# Altium schematic sheet ethernet.SchDoc
size 594 x 420 mm; Author: ALTIUM GOSTBOM2.0 KEV; SheetNumber: 3; SheetTotal: 3
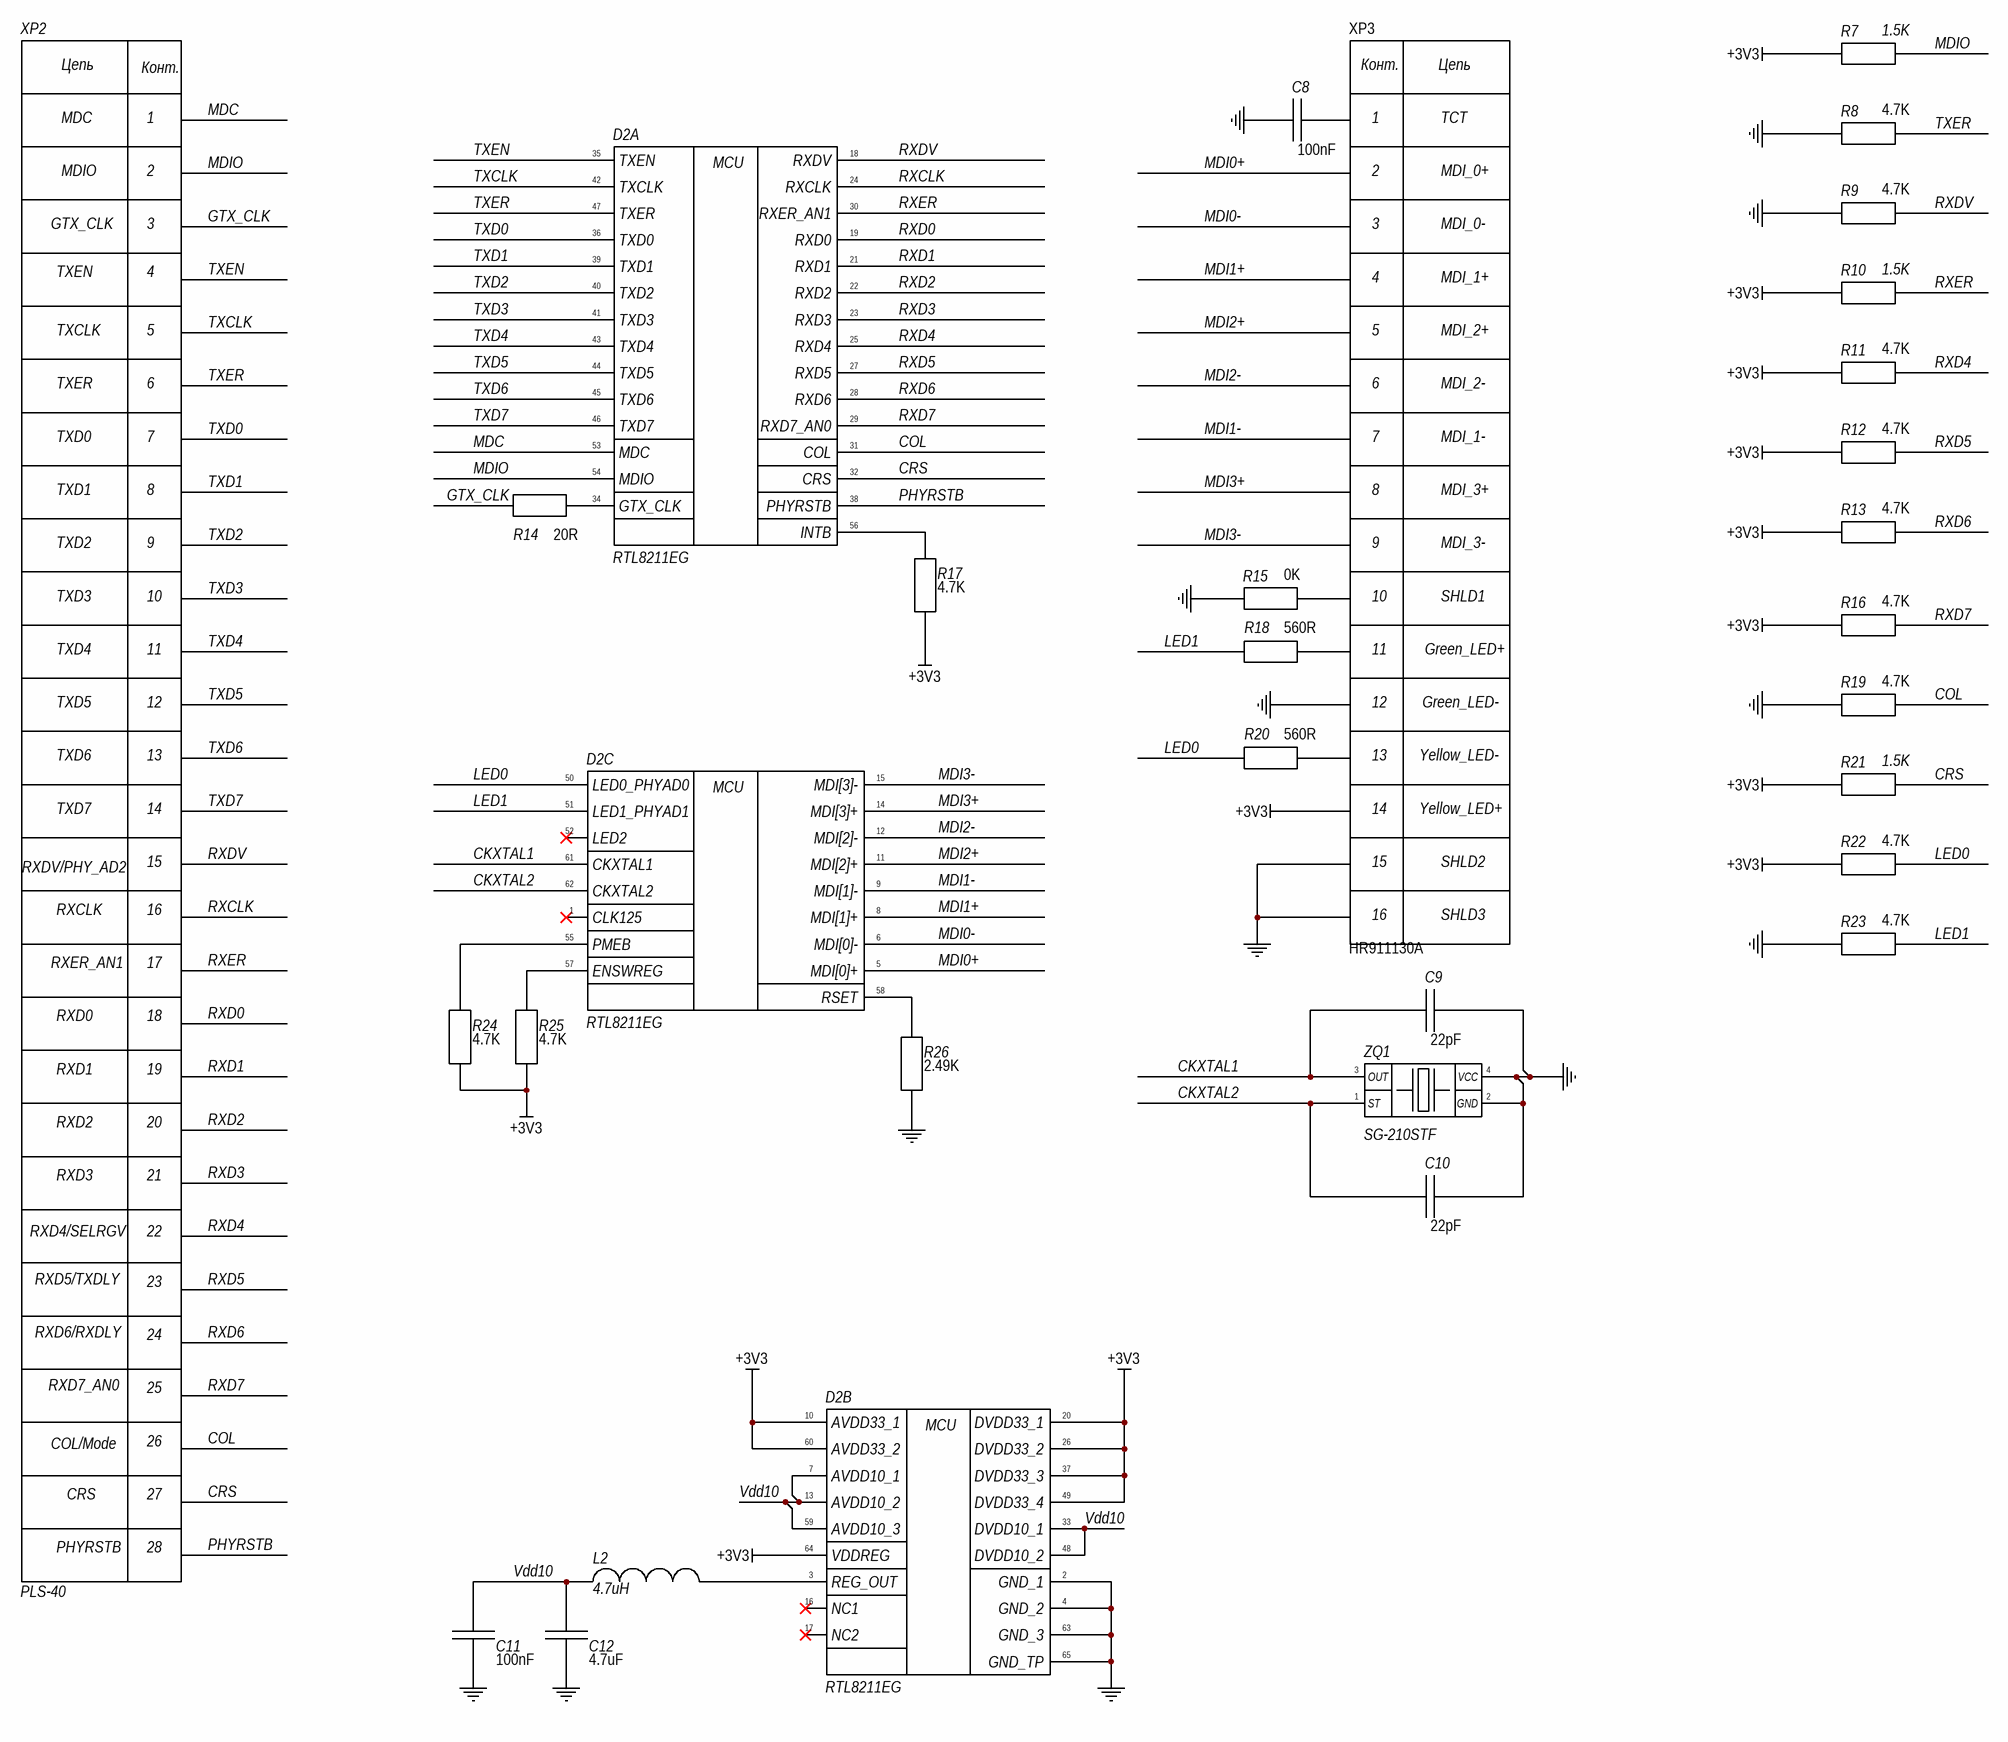
[diagram p0: ethernet.SchDoc]

## Parts
C8  100nF  [SMD 0805]
C9  22pF  [SMD 0805]
C10  22pF  [SMD 0805]
C11  100nF  [SMD 0805]
C12  4.7uF  [SMD 0805]
D2  RTL8211EG  [QFN50P900X900X100_HS-65N]  (parts A,B,C of 3)
L2  4.7uH  [SP43-4R7M]
R7  1.5K  [RESC0805]
R8  4.7K  [RESC0805]
R9  4.7K  [RESC0805]
R10  1.5K  [RESC0805]
R11  4.7K  [RESC0805]
R12  4.7K  [RESC0805]
R13  4.7K  [RESC0805]
R14  20R  [RESC0805]
R15  0K  [RESC0805]
R16  4.7K  [RESC0805]
R17  4.7K  [RESC0805]
R18  560R  [RESC0805]
R19  4.7K  [RESC0805]
R20  560R  [RESC0805]
R21  1.5K  [RESC0805]
R22  4.7K  [RESC0805]
R23  4.7K  [RESC0805]
R24  4.7K  [RESC0805]
R25  4.7K  [RESC0805]
R26  2.49K  [RESC0805]
XP2  PLS-40  [PBD-28]
XP3  HR911130A  [HR911130A]
ZQ1  SG-210STF  [SG-210STF]

## Nets
+3V3: D2.10(AVDD33_1) D2.20(DVDD33_1) D2.26(DVDD33_2) D2.37(DVDD33_3) D2.49(DVDD33_4) D2.60(AVDD33_2) D2.64(VDDREG) R7.1 R10.1 R11.1 R12.1 R13.1 R16.1 R17.1 R21.1 R22.1 R24.1 R25.1 XP3.14
GND: C8.1 C9.2 C10.2 C11.1 C12.1 D2.2(GND_1) D2.4(GND_2) D2.63(GND_3) D2.65(GND_TP) R8.1 R9.1 R15.1 R19.1 R23.1 R26.1 XP3.12 XP3.15 XP3.16 ZQ1.2(GND) ZQ1.4(VCC)
CKXTAL1: C9.1 D2.61(CKXTAL1) ZQ1.3(OUT)
CKXTAL2: C10.1 D2.62(CKXTAL2) ZQ1.1(ST)
COL: D2.31(COL) R19.2 XP2.26
CRS: D2.32(CRS) R21.2 XP2.27
GTX_CLK: R14.1 XP2.3
LED0: D2.50(LED0_PHYAD0) R20.1 R22.2
LED1: D2.51(LED1_PHYAD1) R18.1 R23.2
MDC: D2.53(MDC) XP2.1
MDI0+: D2.5(MDI[0]+) XP3.2
MDI0-: D2.6(MDI[0]-) XP3.3
MDI1+: D2.8(MDI[1]+) XP3.4
MDI1-: D2.9(MDI[1]-) XP3.7
MDI2+: D2.11(MDI[2]+) XP3.5
MDI2-: D2.12(MDI[2]-) XP3.6
MDI3+: D2.14(MDI[3]+) XP3.8
MDI3-: D2.15(MDI[3]-) XP3.9
MDIO: D2.54(MDIO) R7.2 XP2.2
PHYRSTB: D2.38(PHYRSTB) XP2.28
RXCLK: D2.24(RXCLK) XP2.16
RXD0: D2.19(RXD0) XP2.18
RXD1: D2.21(RXD1) XP2.19
RXD2: D2.22(RXD2) XP2.20
RXD3: D2.23(RXD3) XP2.21
RXD4: D2.25(RXD4) R11.2 XP2.22
RXD5: D2.27(RXD5) R12.2 XP2.23
RXD6: D2.28(RXD6) R13.2 XP2.24
RXD7: D2.29(RXD7_AN0) R16.2 XP2.25
RXDV: D2.18(RXDV) R9.2 XP2.15
RXER: D2.30(RXER_AN1) R10.2 XP2.17
TXCLK: D2.42(TXCLK) XP2.5
TXD0: D2.36(TXD0) XP2.7
TXD1: D2.39(TXD1) XP2.8
TXD2: D2.40(TXD2) XP2.9
TXD3: D2.41(TXD3) XP2.10
TXD4: D2.43(TXD4) XP2.11
TXD5: D2.44(TXD5) XP2.12
TXD6: D2.45(TXD6) XP2.13
TXD7: D2.46(TXD7) XP2.14
TXEN: D2.35(TXEN) XP2.4
TXER: D2.47(TXER) R8.2 XP2.6
Vdd10: C11.2 C12.2 D2.7(AVDD10_1) D2.13(AVDD10_2) D2.33(DVDD10_1) D2.48(DVDD10_2) D2.59(AVDD10_3) L2.1
NetC8_2: C8.2 XP3.1
NetD2_3: D2.3(REG_OUT) L2.2
NetD2_34: D2.34(GTX_CLK) R14.2
NetD2_55: D2.55(PMEB) R24.2
NetD2_56: D2.56(INTB) R17.2
NetD2_57: D2.57(ENSWREG) R25.2
NetD2_58: D2.58(RSET) R26.2
NetR15_2: R15.2 XP3.10
NetR18_2: R18.2 XP3.11
NetR20_2: R20.2 XP3.13

Not connected (* = marked no-connect by the designer): D2 1(CLK125)* 16(NC1)* 17(NC2)* 52(LED2)*

## Notes on the sheet
- Подп. дата
- Инв. № дубл.
- Взам. инв. №
- Подп. и дата
- Инв. № подл.
- Изм.
- Лист
- № докум.
- Подп.
- Дата
- ALTIUM GOSTBOM2.0 KEV
- Файл:
- Копировал
- Формат А2
- (in symbol RJ-45) Конт.; Цепь; TCT; MDI_0+; MDI_0-; MDI_1+; MDI_2+; MDI_2-; MDI_1-; MDI_3+; MDI_3-; SHLD1; Green_LED+; Green_LED-; Yellow_LED-; Yellow_LED+; SHLD2; SHLD3
- (in symbol RTL8211EG, part A) MCU
- (in symbol RTL8211EG, part B) MCU
- (in symbol RTL8211EG, part C) MCU
- (in symbol SMT_FPGA) Конт.; Цепь; MDC; MDIO; GTX_CLK; TXEN; TXCLK; TXER; TXD0; TXD1; TXD2; TXD3; TXD4; TXD5; TXD6; TXD7; RXDV/PHY_AD2; RXCLK; RXER_AN1; RXD0; RXD1; RXD2; RXD3; RXD4/SELRGV; RXD5/TXDLY; RXD6/RXDLY; RXD7_AN0; COL/Mode; CRS; PHYRSTB

## Library data of the parts
C8 C11 = 100nF: Конденсатор номиналом 1.5 nF
C9 C10 = 22pF: Конденсатор номиналом 22 pF
C12 = 4.7uF: Конденсатор номиналом 4.7 uF
L2 = 4.7u: Катушка индуктивности 4.7 мкГн
R7 R10 R21 = 1.5K: Резистор номиналом 1.5 кОм
R8 R9 R11-R13 R16 R17 R19 R22-R25 = 4.7K: Резистор номиналом 4.7 кОм
R14 = 20R: Резистор номиналом 20 Ом
R15 = 0K: Резистор номиналом 0 Ом
R18 R20 = 560R: Резистор номиналом 560 Ом
R26 = 2.49K: Резистор номиналом 2.49 кОм
XP2 = SMT_FPGA: Служит для подключения разрабатываемой платы
XP3 = RJ-45: Разъём RJ45 с встроенными трансформаторами и индикацией, 10/100Base-T Ethernet (HR911130A)